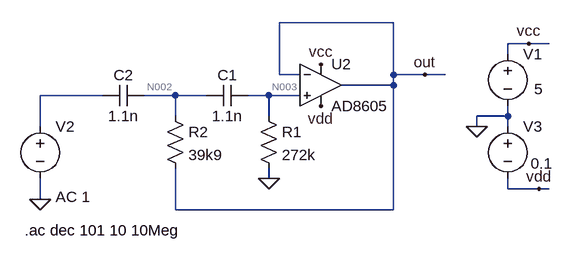
[diagram p0: schematic 01-highpass_ad8605_2nd_chebychev.asc]
01-highpass_ad8605_2nd_chebychev.asc, the LTspice schematic file:
Version 4
SHEET 1 880 680
WIRE 176 48 0 48
WIRE 384 80 352 80
WIRE 416 80 384 80
WIRE 352 96 352 80
WIRE 0 128 0 48
WIRE 32 128 0 128
WIRE 176 128 176 48
WIRE 224 128 176 128
WIRE 256 128 224 128
WIRE 176 144 176 128
WIRE 176 144 96 144
WIRE -272 160 -368 160
WIRE -160 160 -208 160
WIRE -112 160 -160 160
WIRE -16 160 -48 160
WIRE 32 160 -16 160
WIRE -160 192 -160 160
WIRE -16 192 -16 160
WIRE 352 192 352 176
WIRE 352 192 304 192
WIRE -368 208 -368 160
WIRE 304 208 304 192
WIRE 352 208 352 192
WIRE -16 288 -16 272
WIRE 352 304 352 288
WIRE 400 304 352 304
WIRE 416 304 400 304
WIRE -368 320 -368 288
WIRE -160 336 -160 272
WIRE 176 336 176 144
WIRE 176 336 -160 336
FLAG 384 80 vcc
FLAG 64 112 vcc
FLAG -16 288 0
FLAG -368 320 0
FLAG 224 128 out
FLAG 304 208 0
FLAG 400 304 vdd
FLAG 64 176 vdd
SYMBOL voltage 352 80 R0
WINDOW 3 41 70 Left 2
WINDOW 123 0 0 Left 0
WINDOW 39 0 0 Left 0
SYMATTR Value 5
SYMATTR InstName V1
SYMBOL res -32 176 R0
SYMATTR InstName R1
SYMATTR Value 272k
SYMBOL cap -48 144 R90
WINDOW 0 0 32 VBottom 2
WINDOW 3 32 32 VTop 2
SYMATTR InstName C1
SYMATTR Value 1.1n
SYMBOL res -176 176 R0
SYMATTR InstName R2
SYMATTR Value 39k9
SYMBOL cap -208 144 R90
WINDOW 0 0 32 VBottom 2
WINDOW 3 32 32 VTop 2
SYMATTR InstName C2
SYMATTR Value 1.1n
SYMBOL voltage -368 192 R0
WINDOW 123 24 124 Left 2
WINDOW 39 0 0 Left 0
SYMATTR Value2 AC 1
SYMATTR InstName V2
SYMATTR Value ""
SYMBOL voltage 352 192 R0
WINDOW 3 35 73 Left 2
WINDOW 123 0 0 Left 0
WINDOW 39 0 0 Left 0
SYMATTR Value 0.1
SYMATTR InstName V3
SYMBOL OpAmps\\AD8605 64 80 R0
SYMATTR InstName U2
TEXT -392 368 Left 2 !.ac dec 101 10 10Meg

The netlist it stands for:
* 01-highpass_ad8605_2nd_chebychev.asc
V1 vcc 0 5
R1 N003 0 272k
C1 N003 N002 1.1n
R2 N002 out 39k9
C2 N002 N001 1.1n
V2 N001 0 AC 1
V3 0 vdd 0.1
XU2 N003 out vcc vdd out AD8605  ; pins In+ In- V+ V- OUT
.ac dec 101 10 10Meg
.lib ADI.lib
.backanno
.end

* Results of the author's LTspice run, read from the files saved beside the schematic
* Operating Point, zero values left out:
*   V(vcc) = 5 V
*   V(n003) = -13.6 nV
*   V(n002) = -105.2 µV
*   V(out) = -105.2 µV
*   V(vdd) = -100 mV
*   I(V1) = -492.8 µA
*   I(V3) = -492.8 µA
*   Ix(u2:99) = 492.8 µA
*   Ix(u2:50) = -492.8 µA
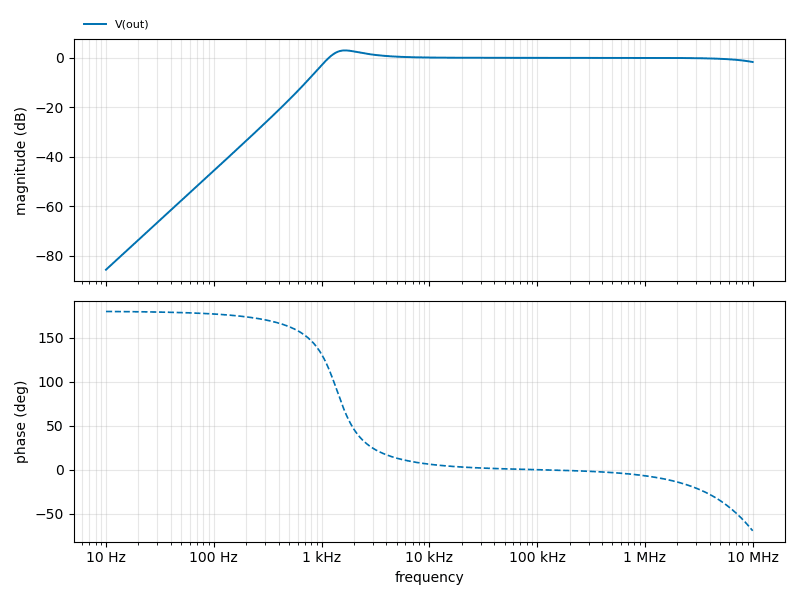
[diagram p1: AC Analysis of 01-highpass_ad8605_2nd_chebychev.asc, plotted from the saved traces]
* AC Analysis, 1 run:
*   V(out): -85.71 dB at 10 Hz, -1.69 dB at 10 MHz, peak 3.00 dB at 1.651 kHz, 3 dB below the peak at 1.168 kHz and 531.7 kHz